# Altium schematic sheet 定时开关模块.SchDoc
size A4
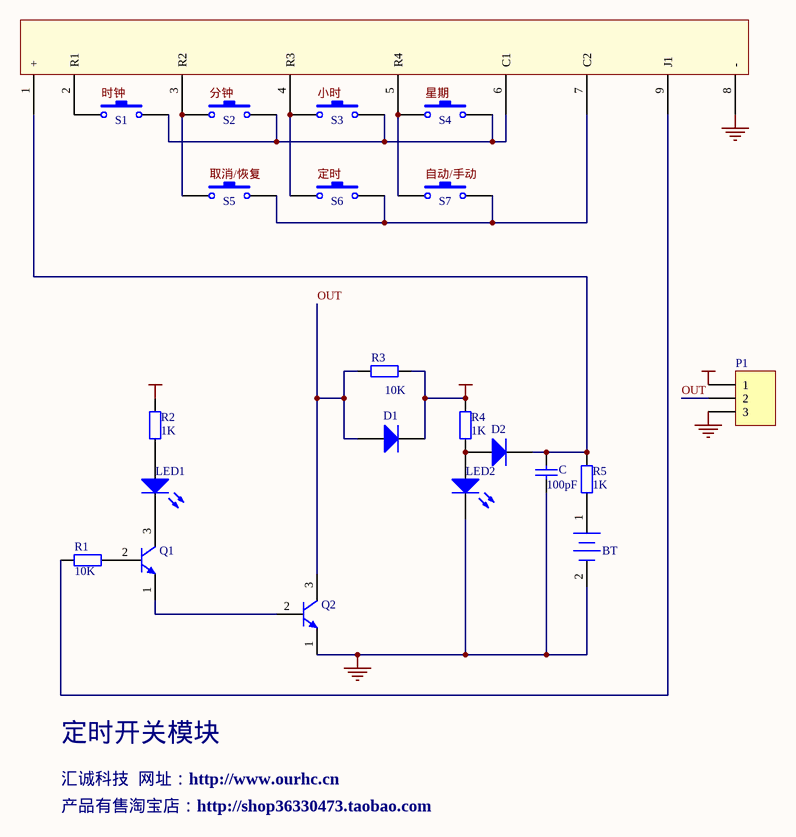
[diagram p0: 定时开关模块.SchDoc]

## Parts
?  (no value)  [HDR-9]
BT  Battery  [PCBComponent_1]  (value not drawn)
C  value 100pF  [TP-0805-R]  (hidden comment: Cap)
D1  Diode 1N4007  [diode0.4-D]  (value not drawn)
D2  Diode 1N4007  [diode0.4-D]  (value not drawn)
LED1  LED1  [TP-0805-D]  (value not drawn)
LED2  LED1  [TP-0805-D]  (value not drawn)
P1  PZ_3  [HDR-3]  (value not drawn)
Q1  2N3904  [SO-G3]  (value not drawn)
Q2  2N3904  [SO-G3]  (value not drawn)
R1  value 10K  [TP-0805-R]  (hidden comment: Res2)
R2  value 1K  [TP-0805-R]  (hidden comment: Res2)
R3  value 10K  [TP-0805-R]  (hidden comment: Res)
R4  value 1K  [TP-0805-R]  (hidden comment: Res2)
R5  value 1K  [TP-0805-R]
S1  SW-PB  [an-6*6]  (value not drawn)
S2  SW-PB  [an-6*6]  (value not drawn)
S3  SW-PB  [an-6*6]  (value not drawn)
S4  SW-PB  [an-6*6]  (value not drawn)
S5  SW-PB  [an-6*6]  (value not drawn)
S6  SW-PB  [an-6*6]  (value not drawn)
S7  SW-PB  [an-6*6]  (value not drawn)

## Nets
GND: ?.8(-) BT.2(-) C.1 LED2.2(K) P1.3 Q2.1(E)
VCC: D1.2(K) P1.1 R2.1 R3.2 R4.2
OUT: D1.1(A) P1.2 Q2.3(C) R3.1
Net?_1: ?.1(+) C.2 D2.2(K) R5.2
Net?_2: ?.2(R1) S1.1
Net?_3: ?.3(R2) S2.1 S5.1
Net?_4: ?.4(R3) S3.1 S6.1
Net?_5: ?.5(R4) S4.1 S7.1
Net?_6: ?.6(C1) S1.2 S2.2 S3.2 S4.2
Net?_7: ?.7(C2) S5.2 S6.2 S7.2
Net?_9: ?.9(J1) R1.1
NetBT_1: BT.1(+) R5.1
NetD2_1: D2.1(A) LED2.1(A) R4.1
NetLED1_1: LED1.1(A) R2.2
NetLED1_2: LED1.2(K) Q1.3(C)
NetQ1_1: Q1.1(E) Q2.2(B)
NetQ1_2: Q1.2(B) R1.2

## Notes on the sheet
- 定时开关模块
- 汇诚科技  网址：http://www.ourhc.cn
- 产品有售淘宝店：http://shop36330473.taobao.com
- Labels drawn without touching a wire or pin: 小时, 分钟, 取消/恢复, 定时, 时钟, 星期, 自动/手动

## Library data of the parts
? = Component_1
BT = Battery: Multicell Battery; Published: 24-Mar-1999; LatestRevisionDate: 17-Jul-2002; LatestRevisionNote: Re-released for DXP Platform.; Publisher: Altium Limited
C = Cap: Capacitor; Published: 8-Jun-2000; LatestRevisionDate: 17-Jul-2002; LatestRevisionNote: Re-released for DXP Platform.; Publisher: Altium Limited
D1 D2 = Diode 1N4007: 1 Amp General Purpose Rectifier; Published: 8-Jun-2000; LatestRevisionDate: 17-Jul-2002; LatestRevisionNote: Re-released for DXP Platform.; DatasheetDocument: 1998; PackageDocument: Aug-1999; PackageReference: DO-41; Publisher: Altium Limited; Code_JEDEC: DO-204-AL
LED1 LED2 = LED1: Typical RED GaAs LED; Published: 8-Jun-2000; LatestRevisionDate: 17-Jul-2002; LatestRevisionNote: Re-released for DXP Platform.; Publisher: Altium Limited
P1 = PZ_3: 排针——3; LatestRevisionDate: 17-Jul-2002; LatestRevisionNote: Re-released for DXP Platform.; Publisher: Altium Limited
Q1 Q2 = 2N3904: NPN General Purpose Amplifier; Published: 8-Jun-2000; LatestRevisionDate: 15-Jan-2003; LatestRevisionNote: PCB Footprint 'BCY-W3/D4.7' replaced; DatasheetDocument: 1997; PackageReference: TO-92A; Publisher: Altium Limited; Code_JEDEC: TO-92A
R1 R2 R4 R5 = Res2: Resistor; Published: 8-Jun-2000; LatestRevisionDate: 17-Jul-2002; LatestRevisionNote: Re-released for DXP Platform.; Publisher: Altium Limited
R3 = Res: 电阻; Published: 8-Jun-2000; LatestRevisionDate: 17-Jul-2002; LatestRevisionNote: Re-released for DXP Platform.; Publisher: Altium Limited
S1-S7 = SW-PB: Switch; Published: 24-Mar-1999; LatestRevisionDate: 17-Jul-2002; LatestRevisionNote: Re-released for DXP Platform.; Publisher: Altium Limited